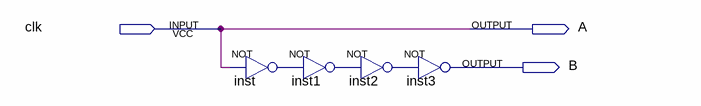
[diagram p0: schematic sheet]
// Quartus schematic Block1.bdf as structural Verilog: 4 symbols, 3 pins
module Block1 (
  input  clk,
  output A,
  output B
);

  wire inst1_out, inst2_out, inst_out;

  not inst (inst_out, clk);
  not inst1 (inst1_out, inst_out);
  not inst2 (inst2_out, inst1_out);
  not inst3 (B, inst2_out);

  assign A = clk;
endmodule
